# EAGLE design BMS Adapter (EAGLE 8.3.1)
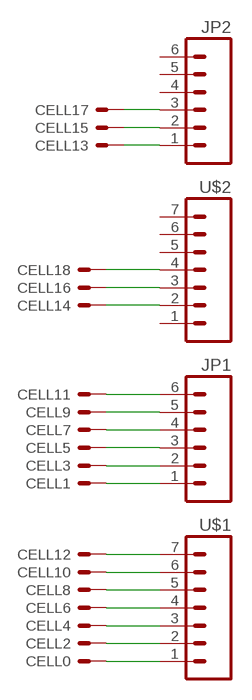
[diagram p0: schematic, sheet 1]

## Parts
CELL0  BATTERY_SPRING_KEYSTONE5222  [KEYSTONE5222]
CELL1  BATTERY_SPRING_KEYSTONE5222  [KEYSTONE5222]
CELL2  BATTERY_SPRING_KEYSTONE5222  [KEYSTONE5222]
CELL3  BATTERY_SPRING_KEYSTONE5222  [KEYSTONE5222]
CELL4  BATTERY_SPRING_KEYSTONE5222  [KEYSTONE5222]
CELL5  BATTERY_SPRING_KEYSTONE5222  [KEYSTONE5222]
CELL6  BATTERY_SPRING_KEYSTONE5222  [KEYSTONE5222]
CELL7  BATTERY_SPRING_KEYSTONE5222  [KEYSTONE5222]
CELL8  BATTERY_SPRING_KEYSTONE5222  [KEYSTONE5222]
CELL9  BATTERY_SPRING_KEYSTONE5222  [KEYSTONE5222]
CELL10  BATTERY_SPRING_KEYSTONE5222  [KEYSTONE5222]
CELL11  BATTERY_SPRING_KEYSTONE5222  [KEYSTONE5222]
CELL12  BATTERY_SPRING_KEYSTONE5222  [KEYSTONE5222]
CELL13  BATTERY_SPRING_KEYSTONE5222  [KEYSTONE5222]
CELL14  BATTERY_SPRING_KEYSTONE5222  [KEYSTONE5222]
CELL15  BATTERY_SPRING_KEYSTONE5222  [KEYSTONE5222]
CELL16  BATTERY_SPRING_KEYSTONE5222  [KEYSTONE5222]
CELL17  BATTERY_SPRING_KEYSTONE5222  [KEYSTONE5222]
CELL18  BATTERY_SPRING_KEYSTONE5222  [KEYSTONE5222]
JP1  M06  [1X06]
JP2  M06  [1X06]
U$1  M07  [1X07]
U$2  M07  [1X07]

## Nets
N$1: CELL0.P$1(S) U$1.1
N$2: CELL2.P$1(S) U$1.2
N$3: CELL4.P$1(S) U$1.3
N$4: CELL6.P$1(S) U$1.4
N$5: CELL8.P$1(S) U$1.5
N$6: CELL10.P$1(S) U$1.6
N$7: CELL12.P$1(S) U$1.7
N$8: CELL1.P$1(S) JP1.1
N$9: CELL3.P$1(S) JP1.2
N$10: CELL5.P$1(S) JP1.3
N$11: CELL7.P$1(S) JP1.4
N$12: CELL9.P$1(S) JP1.5
N$13: CELL11.P$1(S) JP1.6
N$14: CELL18.P$1(S) U$2.4
N$15: CELL16.P$1(S) U$2.3
N$16: CELL14.P$1(S) U$2.2
N$17: CELL13.P$1(S) JP2.1
N$18: CELL15.P$1(S) JP2.2
N$19: CELL17.P$1(S) JP2.3
Unconnected: JP2.4 JP2.5 JP2.6 U$2.1 U$2.5 U$2.6 U$2.7

## Library data of the parts
CELL0 CELL1-CELL18 = HyTechDevices:BATTERY_SPRING: Keystone Electronics Battery Spring Contact Datasheet <http://keyelco.com/userAssets/file/M65p17.pdf>
JP1 JP2 = HyTechDevices:M06: Standard 6-pin 0.1" header. NOTES ON THE VARIANTS LOCK and LOCK_LONGPADS... This footprint was designed to help hold the alignment of a through-hole component (i.e. 6-pin header) while soldering it into place. You may notice that each hole has been shifted either up or down by 0.005 of an inch from it's more standard position (which is a perfectly straight line). This slight alteration caused the pins (the squares in the middle) to touch the edges of the holes. Because they are alternating, it causes a "brace" to hold the component in place. 0.005 has proven to be the perfect amount of "off-center" position when using our standard breakaway headers. Although looks a little odd when you look at the bare footprint, once you have a header in there, the alteration is very hard to notice. Also,if you push a header all the way into place, it is covered up entirely on the bottom side. This idea of altering the position of holes to aid alignment will be further integrated into the Sparkfun Library for other footprints. It can help hold any component with 3 or more connection pins. Note: The Sparkfun version includes many other packages including surface mount that may be of future interest. Source: Sparkfun <https://github.com/sparkfun/SparkFun-Eagle-Libraries>
U$1 U$2 = HyTechDevices:M07

## Module DRAIN+FILTER
Ports: CELL+(in) CELL-(out) S(N)(in) C(N)(out) V-(pwr)
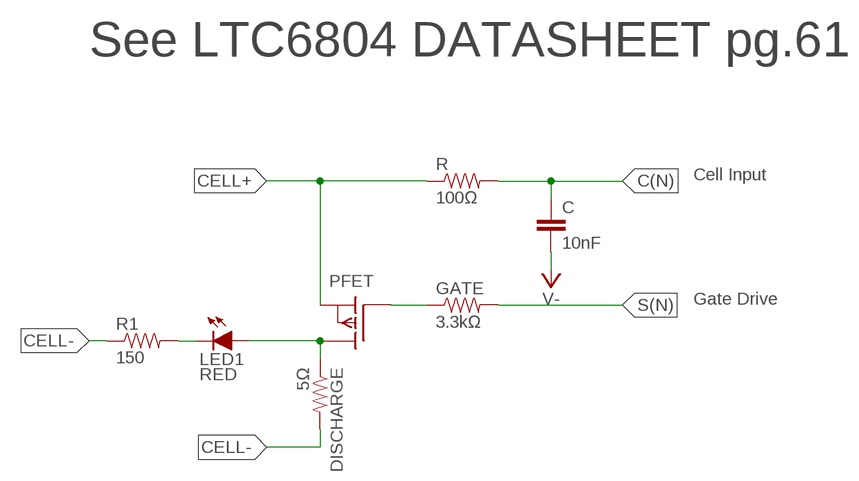
[diagram p1: schematic, module DRAIN+FILTER, sheet 1]

### Parts
C  10nF  CAP0805  [0805]
DISCHARGE  5Ω  RESISTORPWR163  [PWR163]
GATE  3.3kΩ  RESISTOR0805-RES  [0805]
LED1  RED  LED-0805  [LED-805]
PFET  P-CHANNEL_MOSFET_DMP3099L-7  [SOT23]
R  100Ω  RESISTOR0805-RES  [0805]
R1  150  RESISTOR0805-RES  [0805]

### Nets
C(N): C.1 R.2
CELL+: PFET.2(S) R.1
CELL-: DISCHARGE.2 R1.1
GATE: GATE.1 PFET.1(G)
N$1: DISCHARGE.1 LED1.A PFET.3(D)
N$2: LED1.C R1.2
S(N): GATE.2
V-: C.2

### Notes on the sheet
- See LTC6804 DATASHEET pg.61
- Cell Input
- Gate Drive

### Library data of the parts
C = HyTechDevices:CAP: Capacitor Standard 0603 ceramic capacitor, and 0.1" leaded capacitor.
DISCHARGE GATE R R1 = HyTechDevices:RESISTOR: Resistor Basic schematic elements and footprints for 0603, 1206, and PTH resistors.
LED1 = HyTechDevices:LED: Light Emitting Diode (LED) Source: Dangerous Prototypes Eagle Library <https://github.com/DangerousPrototypes/Eagle_Part_Library>
PFET = HyTechDevices:P-CHANNEL_MOSFET_DMP3099L-7: Diodes Incorporated P-Channel Enhancement Mode MOSFET Datasheet <http://www.mouser.com/ds/2/115/DMP3099L-266220.pdf>

## Module THERM_FILTER
Ports: VREF(pwr) GPIO(out) THERM(nc) V-(pwr)
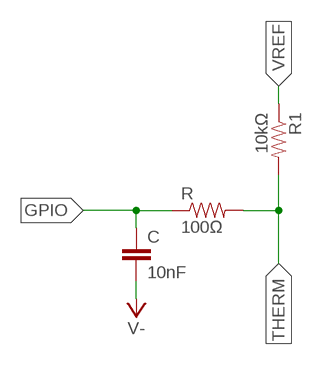
[diagram p2: schematic, module THERM_FILTER, sheet 1]

### Parts
C  10nF  CAP0805  [0805]
R  100Ω  RESISTOR0805-RES  [0805]
R1  10kΩ  RESISTOR0805-RES  [0805]

### Nets
GPIO: C.1 R.1
THERM: R1.2 R.2
V-: C.2
VREF: R1.1

### Library data of the parts
C = HyTechDevices:CAP: Capacitor Standard 0603 ceramic capacitor, and 0.1" leaded capacitor.
R R1 = HyTechDevices:RESISTOR: Resistor Basic schematic elements and footprints for 0603, 1206, and PTH resistors.

## Board
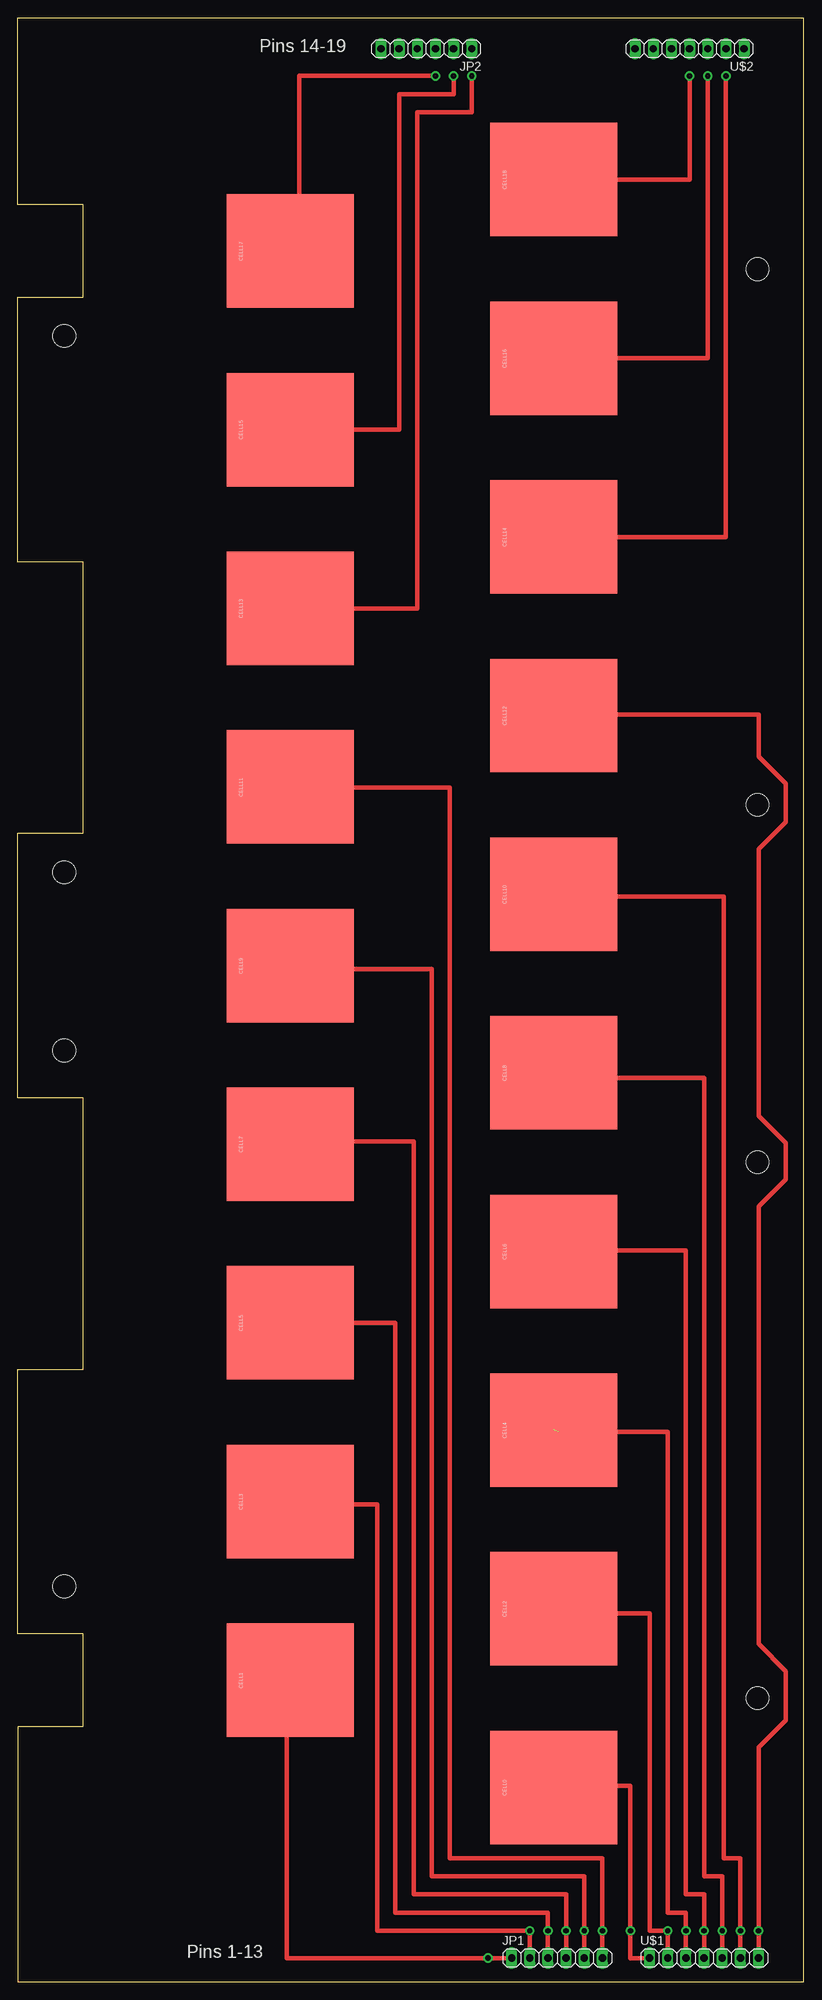
[diagram p3: board, top side]
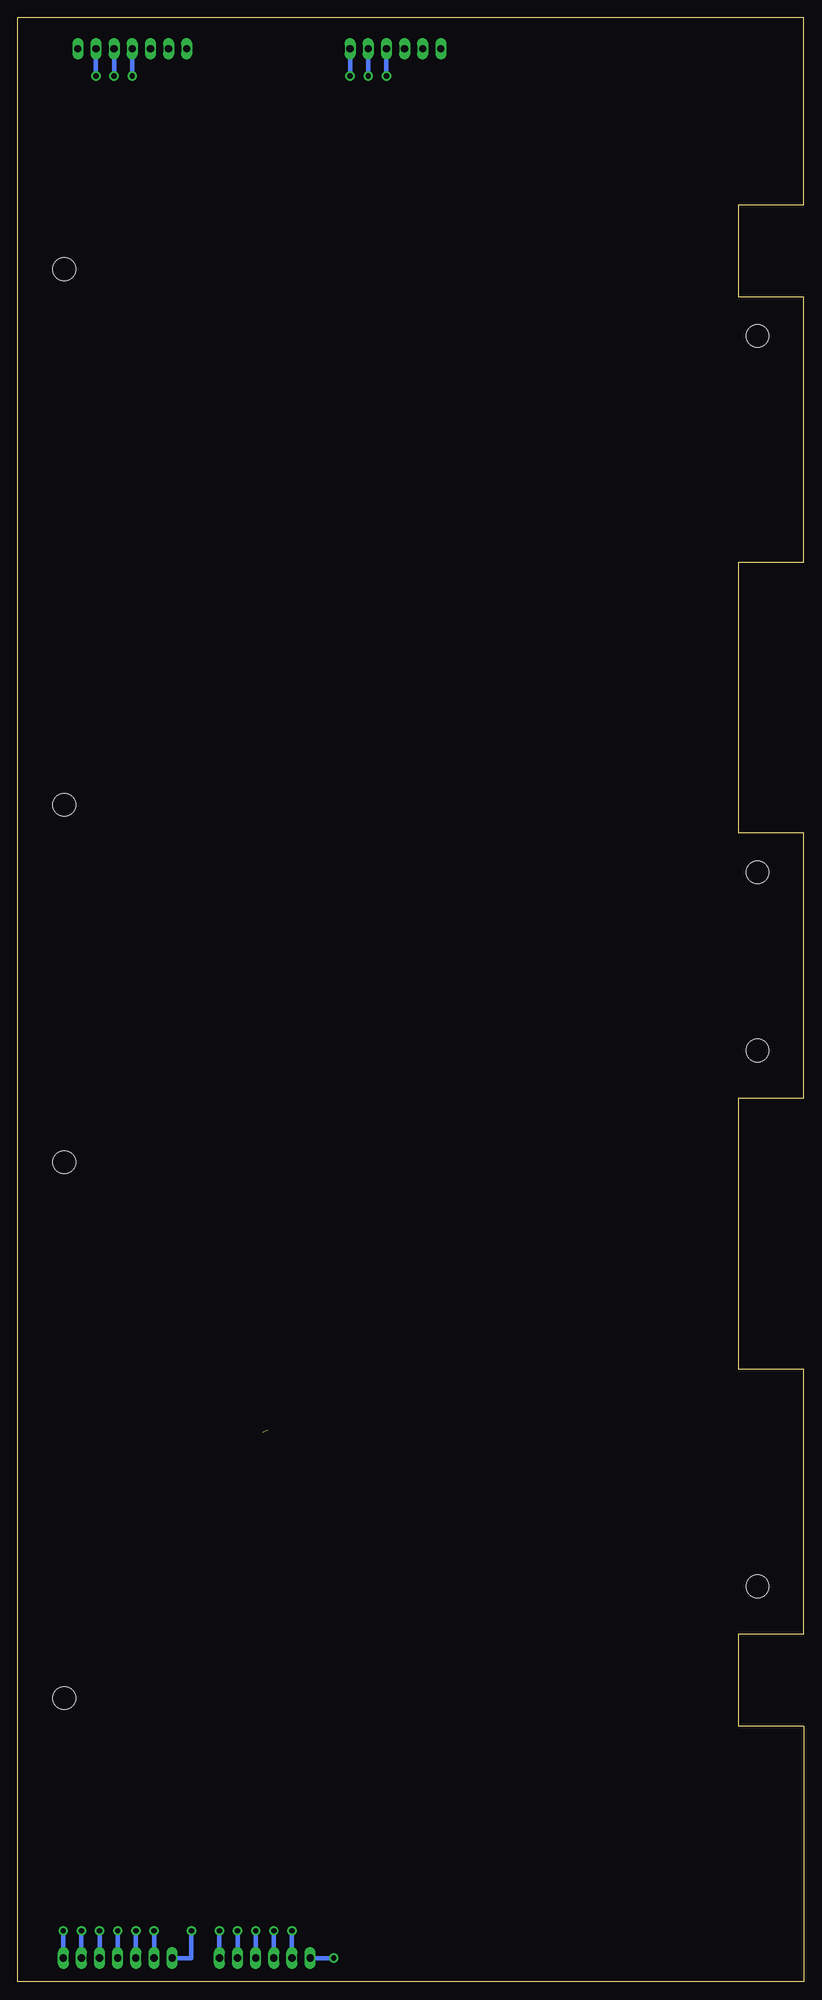
[diagram p4: board, bottom side, seen from below]

Size 109.98 x 274.83 mm. Coordinates in mm from the lower left corner, seen from the top.
Outline: 0,0 109.98,0 109.98,274.83 0,274.83 0,248.67 9.14,248.67 9.14,235.71 0,235.71 0,198.67 9.14,198.67 9.14,160.71 0,160.71 0,123.67 9.14,123.67 9.14,85.71 0,85.71 0,48.67 9.14,48.67 9.14,35.71 0,35.71 0,0
Copper layers (1*16): Top 0.035mm / dielectric 1.5mm / Bottom 0.035mm
Design rules "DRC Advanced Circuits *": minimum track width 6mil, minimum drill 15mil, track to track 24mil, track to pad 24mil, pad to pad 24mil, via to via 24mil, smd to smd 24mil, copper to edge 40mil, drill to drill 6mil, minimum pad ring 10mil, minimum via ring 8mil, stop-mask expansion 4mil, vias tented up to drill 0mil, thermal gap 10mil
Holes 3.2 mm at 6.5,55.31 6.5,130.31 103.5,114.69 103.5,39.69 6.5,155.25 103.5,164.69 6.49,230.31 103.5,239.66
bKeepout: area 58.4,0 to 110,12.7; area 53.3,262.1 to 110,274.8

### Footprints (pad centres in the part's own frame; a part is rotated, then mirrored left to right if it is on the bottom)
KEYSTONE5222 = smd 15.875 x 17.78: P$1 0,0
1X06 = drill 1.016 long: 1 -6.35,0; 2 -3.81,0; 3 -1.27,0; 4 1.27,0; 5 3.81,0; 6 6.35,0
1X07 = drill 1.016 long: 1 -7.62,0; 2 -5.08,0; 3 -2.54,0; 4 0,0; 5 2.54,0; 6 5.08,0; 7 7.62,0

### Placement (x,y rotation side)
CELL0  75,27.19 270 top
CELL1  38.1,42.19 270 top
CELL2  75,52.19 270 top
CELL3  38.1,67.19 270 top
CELL4  75,77.19 270 top
CELL5  38.1,92.19 270 top
CELL6  75,102.19 270 top
CELL7  38.1,117.19 270 top
CELL8  75,127.19 270 top
CELL9  38.1,142.19 270 top
CELL10  75,152.19 270 top
CELL11  38.1,167.19 270 top
CELL12  75,177.19 270 top
CELL13  38.1,192.19 270 top
CELL14  75,202.19 270 top
CELL15  38.1,217.19 270 top
CELL16  75,227.19 270 top
CELL17  38.1,242.19 270 top
CELL18  75,252.19 270 top
JP1  75.44,3.3 0 top
JP2  57.15,270.51 180 top
U$1  96.01,3.3 0 top
U$2  93.98,270.51 180 top

### Tracks (layer width: path | path; a pad name or v marks a point on that pad's centre or on a via)
N$1  (via drill 0.75 pad 1.3)
  Top 0.61: CELL0.P$1 75.69,26.49 75.69,26.16 76.96,27.43 85.7,27.43 v85.7,7.11 85.7,3.3 U$1.1
  Bottom 0.61: v85.7,7.11 85.7,3.3 U$1.1
N$2  (via drill 0.75 pad 1.3)
  Top 0.61: CELL2.P$1 75.62,51.56 88.39,51.56 88.39,7.11 v90.93,7.11 U$1.2
  Bottom 0.61: v90.93,7.11 U$1.2
N$3  (via drill 0.75 pad 1.3)  (1 unrouted)
  Top 0.61: U$1.3 v93.47,7.11 93.47,9.65 90.93,9.65 90.93,76.96 75.69,76.96
  Bottom 0.61: v93.47,7.11 U$1.3
N$4  (via drill 0.75 pad 1.3)
  Top 0.61: U$1.4 v96.01,7.11 96.01,12.19 93.47,12.19 93.47,102.36 74.82,102.36 | 74.42,102.36 74.82,102.36 | 74.82,102.36 CELL6.P$1
  Bottom 0.61: v96.01,7.11 U$1.4
N$5  (via drill 0.75 pad 1.3)
  Top 0.61: U$1.5 v98.55,7.11 98.55,14.73 96.01,14.73 96.01,126.49 76.96,126.49 75.69,127.76 75.57,127.76 CELL8.P$1
  Bottom 0.61: v98.55,7.11 U$1.5
N$6  (via drill 0.75 pad 1.3)
  Top 0.61: U$1.6 v101.09,7.11 101.09,17.27 98.74,17.27 98.74,151.89 75.29,151.89 CELL10.P$1
  Bottom 0.61: v101.09,7.11 U$1.6
N$7  (via drill 0.75 pad 1.3)
  Top 0.61: CELL12.P$1 75.1,177.29 103.63,177.29 103.63,171.45 107.44,167.64 107.44,162.31 103.63,158.5 103.63,121.16 107.44,117.35 107.44,112.27 103.63,108.46 103.63,47.24 107.44,43.43 107.44,36.58 103.63,32.77 v103.63,7.11 U$1.7
  Bottom 0.61: v103.63,7.11 U$1.7
N$8  (via drill 0.75 pad 1.3)
  Top 0.61: v65.79,3.3 JP1.1 | v65.79,3.3 37.59,3.3 37.59,41.4 38.1,41.4 CELL1.P$1 | 65.53,3.3 v65.79,3.3
  Bottom 0.61: v65.79,3.3 JP1.1
N$9  (via drill 0.75 pad 1.3)
  Top 0.61: CELL3.P$1 38.1,66.8 50.29,66.8 50.29,7.11 v71.63,7.11 JP1.2
  Bottom 0.61: JP1.2 v71.63,7.11
N$10  (via drill 0.75 pad 1.3)
  Top 0.61: CELL5.P$1 38.1,92.2 52.83,92.2 52.83,9.65 74.17,9.65 v74.17,7.11 JP1.3
  Bottom 0.61: v74.17,7.11 JP1.3
N$11  (via drill 0.75 pad 1.3)
  Top 0.61: CELL7.P$1 38.1,117.6 55.37,117.6 55.37,12.19 76.71,12.19 v76.71,7.11 | v76.71,7.11 JP1.4 | 76.71,6.86 v76.71,7.11
  Bottom 0.61: v76.71,7.11 JP1.4
N$12  (via drill 0.75 pad 1.3)
  Top 0.61: v79.25,7.11 JP1.5 | v79.25,7.11 79.25,14.73 57.91,14.73 57.91,141.73 38.1,141.73 CELL9.P$1 | 79.5,7.37 v79.25,7.11
  Bottom 0.61: v79.25,7.11 JP1.5
N$13  (via drill 0.75 pad 1.3)
  Top 0.61: JP1.6 v81.79,7.11 81.79,17.27 60.45,17.27 60.45,167.13 38.16,167.13 CELL11.P$1
  Bottom 0.61: v81.79,7.11 JP1.6
N$14  (1 unrouted)
  Top 0.61: CELL18.P$1 93.98,252.19 93.98,266.7
  Bottom 0.61: U$2.4 93.98,266.7
N$15  (1 unrouted)
  Top 0.61: CELL16.P$1 96.52,227.19 96.52,266.7
  Bottom 0.61: U$2.3 96.52,266.7
N$16  (1 unrouted)
  Top 0.61: CELL14.P$1 99.06,202.19 99.06,266.7
  Bottom 0.61: U$2.2 99.06,266.7
N$17  (1 unrouted)
  Top 0.61: CELL13.P$1 55.88,192.19 55.88,261.62 63.5,261.62 63.5,266.7
  Bottom 0.61: JP2.1 63.5,266.7
N$18  (1 unrouted)
  Top 0.61: CELL15.P$1 53.34,217.19 53.34,264.16 60.96,264.16 60.96,266.7
  Bottom 0.61: JP2.2 60.96,266.7
N$19  (1 unrouted)
  Top 0.61: CELL17.P$1 39.37,242.19 39.37,266.7 58.42,266.7
  Bottom 0.61: JP2.3 58.42,266.7
N$20  (via drill 0.75 pad 1.3)
  other vias: 93.98,266.7
N$21  (via drill 0.75 pad 1.3)
  other vias: 63.5,266.7
N$24  (via drill 0.75 pad 1.3)
  other vias: 96.52,266.7
N$25  (via drill 0.75 pad 1.3)
  other vias: 99.06,266.7
N$26  (via drill 0.75 pad 1.3)
  other vias: 60.96,266.7
N$27  (via drill 0.75 pad 1.3)
  other vias: 58.42,266.7

### Text on the board
tPlace: Pins 14-19 | Pins 1-13
tDocu: Rubout entire top layer / / Rubout bottom layer / around connectors / (see bKeepout layer)